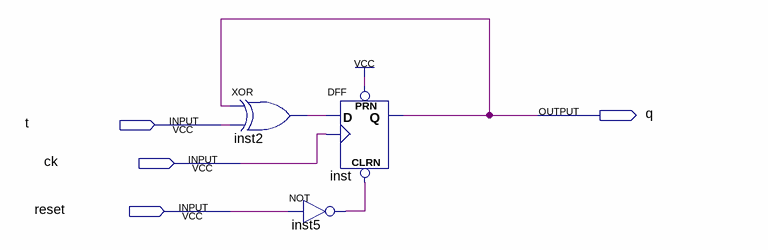
[diagram p0: schematic sheet]
// Quartus schematic pfs_toggle_ff.bdf as structural Verilog: 3 symbols, 4 pins
module pfs_toggle_ff (
  input  t,
  input  ck,
  input  reset,
  output q
);

  wire inst2_out, inst5_out;

  xor inst2 (inst2_out, q, t);
  DFF inst (.CLRN(inst5_out), .CLK(ck), .D(inst2_out), .PRN(1'b1), .Q(q));
  not inst5 (inst5_out, reset);
endmodule
